# EAGLE design datalogger-v12 (EAGLE 7.7.0)
DATABASE: /Users/kina/Documents/eagle/PARTSDB.txt

## Sheet 1 of 2
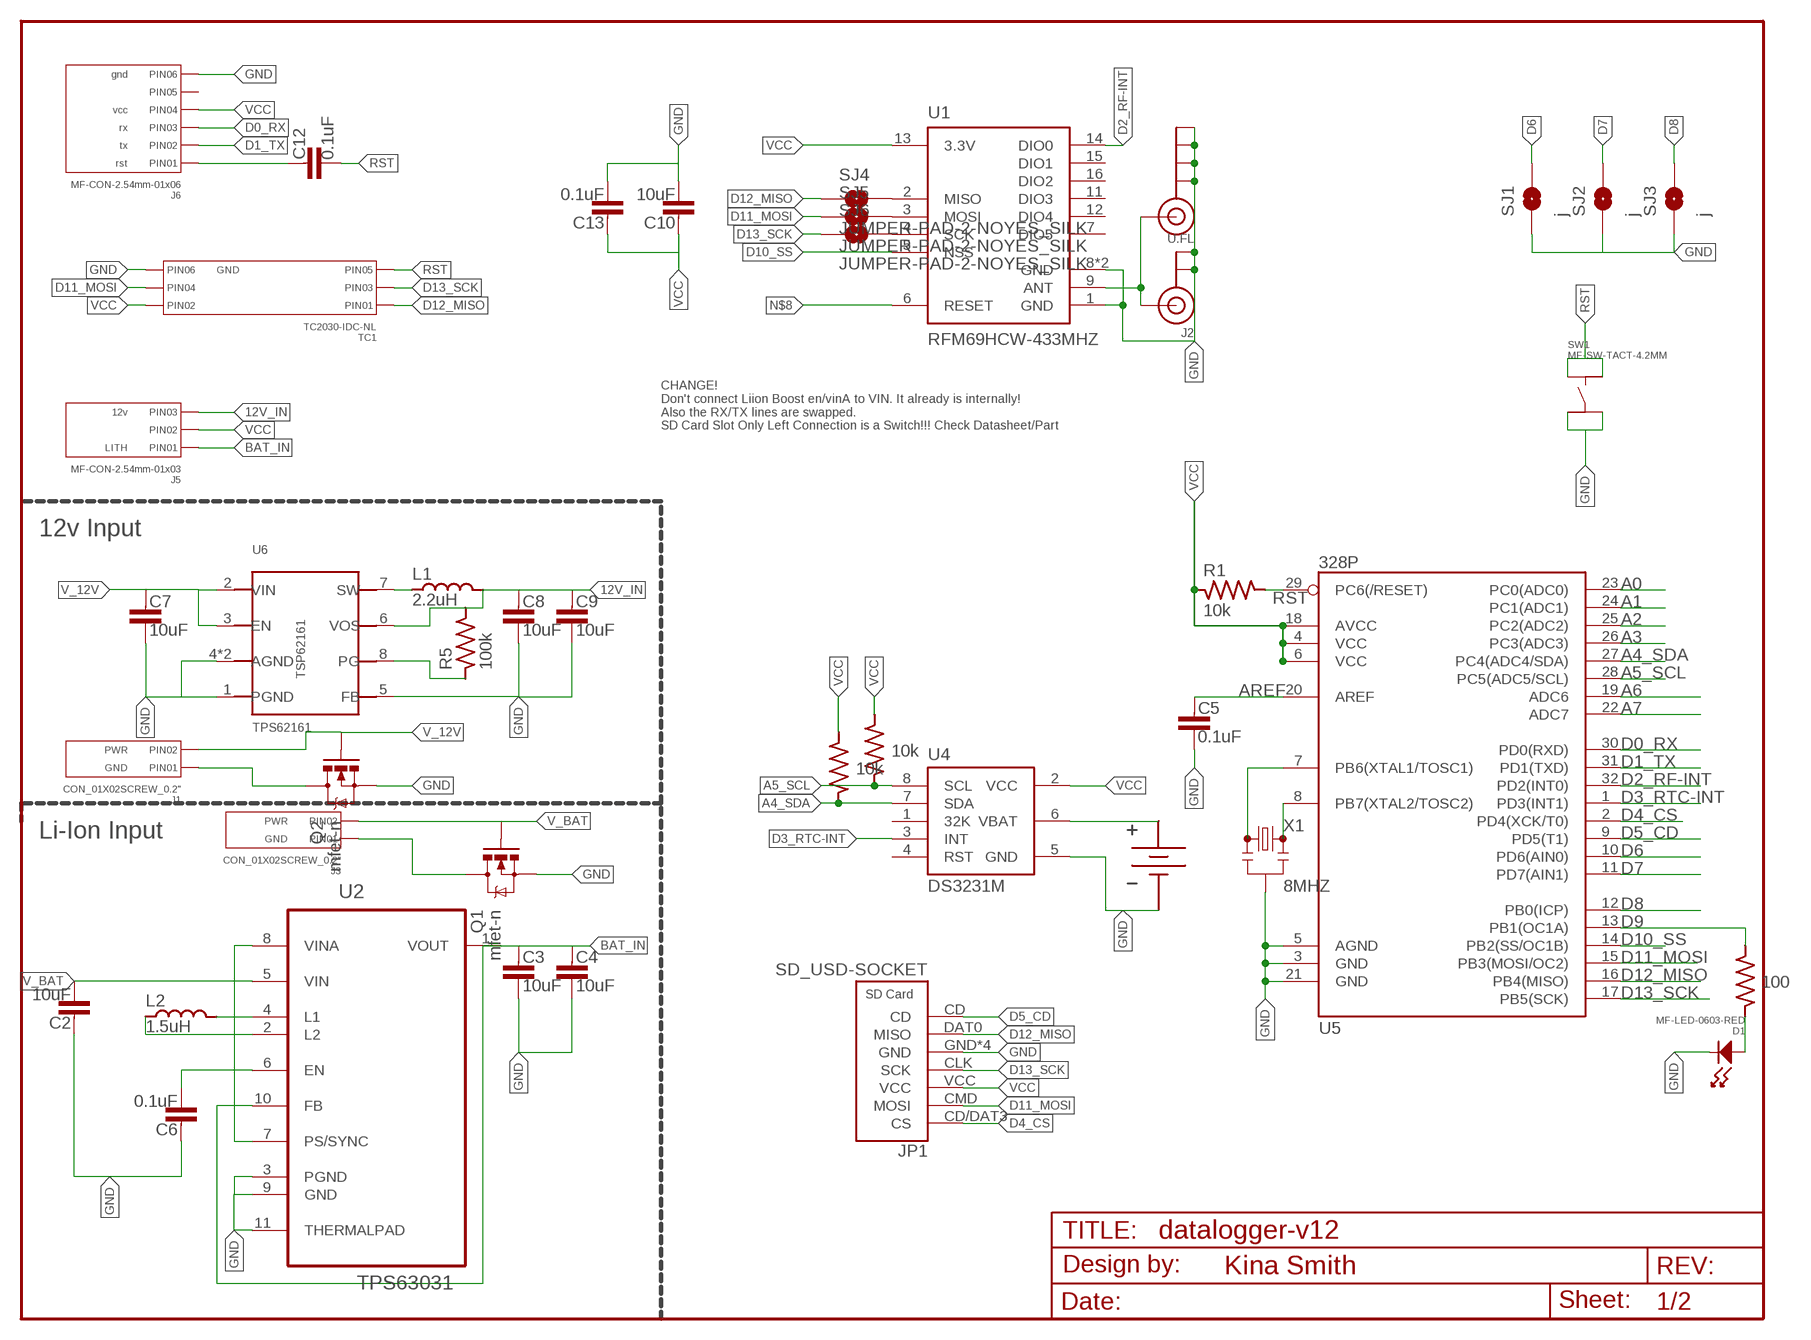
[diagram p0: schematic, sheet 1]

### Parts
BAT1  BATTERY_HOLDER12MM  [BAT_12MM]
C2  10uF  CAPACITOR_NP0805-N  [C0805-N]
C3  10uF  CAPACITOR_NP0805-N  [C0805-N]
C4  10uF  CAPACITOR_NP0805-N  [C0805-N]
C5  0.1uF  CAPACITOR_NP0603-N  [C0603-N]
C6  0.1uF  CAPACITOR_NP0603-N  [C0603-N]
C7  10uF  CAPACITOR_NP0805-N  [C0805-N]
C8  10uF  CAPACITOR_NP0805-N  [C0805-N]
C9  10uF  CAPACITOR_NP0805-N  [C0805-N]
C10  10uF  CAPACITOR_NP0805-N  [C0805-N]
C12  0.1uF  CAPACITOR_NP0603-N  [C0603-N]
C13  0.1uF  CAPACITOR_NP0603-N  [C0603-N]
D1  MF-LED-0603-RED  LED_SINGLE-0603-RED  [LED0603]
FRAME1  FRAME-LETTERNO_PACKAGE  [DUMMY]
J1  CON_01X02SCREW_0.2"  [SCREW_TERM_2POS]
J2  U.FL  ANTENNA_U.FL  [ADAFRUIT_U.FL]
J3  CON_01X02SCREW_0.2"  [SCREW_TERM_2POS]
J4  ANTENNA_SMA_EDGE  [SMA-EDGE]
J5  MF-CON-2.54mm-01x03  CON_01X03_PTH_2.54MM  [PTH_2.54MM_01X03]
J6  MF-CON-2.54mm-01x06  CON_01X06_PTH_2.54MM  [PTH_2.54MM_01X06]
JP1  SD_USD-SOCKET  [MICRO-SD-SOCKET-SDIO]
L1  2.2uH  INDUCTOR2520  [L2520]
L2  1.5uH  INDUCTOR3030  [L3030]
Q1  mfet-n  MOSFET-NCHANNELSOT23-3  [SOT23-3]
Q2  mfet-n  MOSFET-NCHANNELSOT23-3  [SOT23-3]
R1  10k  RESISTOR0603-N  [R0603-N]
R2  100  RESISTOR0603-N  [R0603-N]
R3  10k  RESISTOR0603-N  [R0603-N]
R4  10k  RESISTOR0603-N  [R0603-N]
R5  100k  RESISTOR0603-N  [R0603-N]
SJ1  j  JUMPER-PAD-2-NOYES_SILK  [PAD-JUMPER-2-NO_YES_SILK]
SJ2  j  JUMPER-PAD-2-NOYES_SILK  [PAD-JUMPER-2-NO_YES_SILK]
SJ3  j  JUMPER-PAD-2-NOYES_SILK  [PAD-JUMPER-2-NO_YES_SILK]
SJ4  JUMPER-PAD-2-NOYES_SILK  [PAD-JUMPER-2-NO_YES_SILK]
SJ5  JUMPER-PAD-2-NOYES_SILK  [PAD-JUMPER-2-NO_YES_SILK]
SJ6  JUMPER-PAD-2-NOYES_SILK  [PAD-JUMPER-2-NO_YES_SILK]
SW1  MF-SW-TACT-4.2MM  TACT_4.2MM  [TACT4.2MM]
TC1  TC2030-IDC-NL  CON_02X03_AVRISP_TC2030-IDC-NL  [TC2030-IDC-NL]
U1  RFM69HCW-433MHZ  [RFM69HCW-XXXS2]
U2  TPS63031  [SON50P260X260X80-11N]
U4  DS3231M  [SO08]
U5  328P  ATMEGA328P-AU  [TQFP32-08]
U6  TPS62161  [WSON-8]
X1  8MHZ  RESONATOR8MHZ  [RESONATOR-SMD]

### Nets
3V3L1: L2.P$2 U2.4(L1)
3V3L2: L2.P$1 U2.2(L2)
12V_IN: C8.1 C9.1 J5.P$3(PIN3) L1.P$2 R5.2 U6.6(VOS)
A0: U5.23(PC0(ADC0))
A1: U5.24(PC1(ADC1))
A2: U5.25(PC2(ADC2))
A3: U5.26(PC3(ADC3))
A4_SDA: R4.1 U4.7(SDA) U5.27(PC4(ADC4/SDA))
A5_SCL: R3.1 U4.8(SCL) U5.28(PC5(ADC5/SCL))
A6: U5.19(ADC6)
A7: U5.22(ADC7)
ANT: J2.3(SIGNAL) J4.SIG(SIGNAL) U1.9(ANT)
AREF: C5.1 U5.20(AREF)
BAT_IN: C3.1 C4.1 J5.P$1(PIN1) U2.1(VOUT) U2.10(FB)
D0_RX: J6.P$3(PIN3) U5.30(PD0(RXD))
D1_TX: J6.P$2(PIN2) U5.31(PD1(TXD))
D2_RF-INT: U1.14(DIO0) U5.32(PD2(INT0))
D3_RTC-INT: U4.3(INT) U5.1(PD3(INT1))
D4_CS: JP1.CD/DAT3(CS) U5.2(PD4(XCK/T0))
D5_CD: JP1.CD U5.9(PD5(T1))
D6: SJ1.2 U5.10(PD6(AIN0))
D7: SJ2.2 U5.11(PD7(AIN1))
D8: SJ3.2 U5.12(PB0(ICP))
D9: R2.2 U5.13(PB1(OC1A))
D10_SS: U1.5(NSS) U5.14(PB2(SS/OC1B))
D11_MOSI: JP1.CMD(MOSI) SJ5.1 TC1.P$4(PIN4) U5.15(PB3(MOSI/OC2))
D12_MISO: JP1.DAT0(MISO) SJ4.1 TC1.P$1(PIN1) U5.16(PB4(MISO))
D13_SCK: JP1.CLK(SCK) SJ6.1 TC1.P$3(PIN3) U5.17(PB5(SCK))
EN: C6.2 U2.6(EN) U2.7(PS/SYNC) U2.8(VINA)
GND [power]: BAT1.GND C2.1 C3.2 C4.2 C5.2 C6.1 C7.2 C8.2 C9.2 C10.2 C13.2 D1.CATHODE J2.1(GND) J2.2(GND) J4.GND@0(GND) J4.GND@1(GND) J4.GND@2(GND) J4.GND@3(GND) J6.P$6(PIN6) JP1.GND JP1.GND1(GND) JP1.GND2(GND) JP1.GND3(GND) Q1.2(S) Q2.2(S) SJ1.1 SJ2.1 SJ3.1 SW1.P$3 SW1.P$4 TC1.P$6(PIN6) U1.1(GND) U1.8(GND) U1.10(GND) U2.3(PGND) U2.9(GND) U2.11(THERMALPAD) U4.5(GND) U5.3(GND) U5.5(AGND) U5.21(GND) U6.1(PGND) U6.4(AGND) U6.5(FB) U6.P$9(AGND) X1.2
N$1: U5.7(PB6(XTAL1/TOSC1)) X1.1
N$2: D1.ANODE R2.1
N$4: C12.1 J6.P$1(PIN1)
N$5: J3.GND(PIN1) Q1.3(D)
N$7: SJ4.2 U1.2(MISO)
N$8: U1.6(RESET)
N$9: SJ5.2 U1.3(MOSI)
N$10: BAT1.PWR@1(VBAT) BAT1.PWR@2(VBAT) U4.6(VBAT)
N$11: J1.GND(PIN1) Q2.3(D)
N$15: SJ6.2 U1.4(SCK)
N$18: R5.1 U6.8(PG)
N$21: U5.8(PB7(XTAL2/TOSC2)) X1.3
RST: C12.2 R1.2 SW1.P$1 SW1.P$2 TC1.P$5(PIN5) U5.29(PC6(/RESET))
SW: L1.P$1 U6.7(SW)
V_12V: C7.1 J1.PWR(PIN2) Q2.1(G) U6.2(VIN) U6.3(EN)
V_BAT: C2.2 J3.PWR(PIN2) Q1.1(G) U2.5(VIN)
VCC: C10.1 C13.1 J5.P$2(PIN2) J6.P$4(PIN4) JP1.VCC R1.1 R3.2 R4.2 TC1.P$2(PIN2) U1.13(3.3V) U4.2(VCC) U5.4(VCC) U5.6(VCC) U5.18(AVCC)
Unconnected: J6.P$5(PIN5) U1.7(DIO5) U1.11(DIO3) U1.12(DIO4) U1.15(DIO1) U1.16(DIO2) U4.1(32K) U4.4(RST)

### Notes on the sheet
- CHANGE!
  Don't connect Liion Boost en/vinA to VIN. It already is internally!
  Also the RX/TX lines are swapped. 
  SD Card Slot Only Left Connection is a Switch!!! Check Datasheet/Part
- 12v Input
- Li-Ion Input

## Sheet 2 of 2
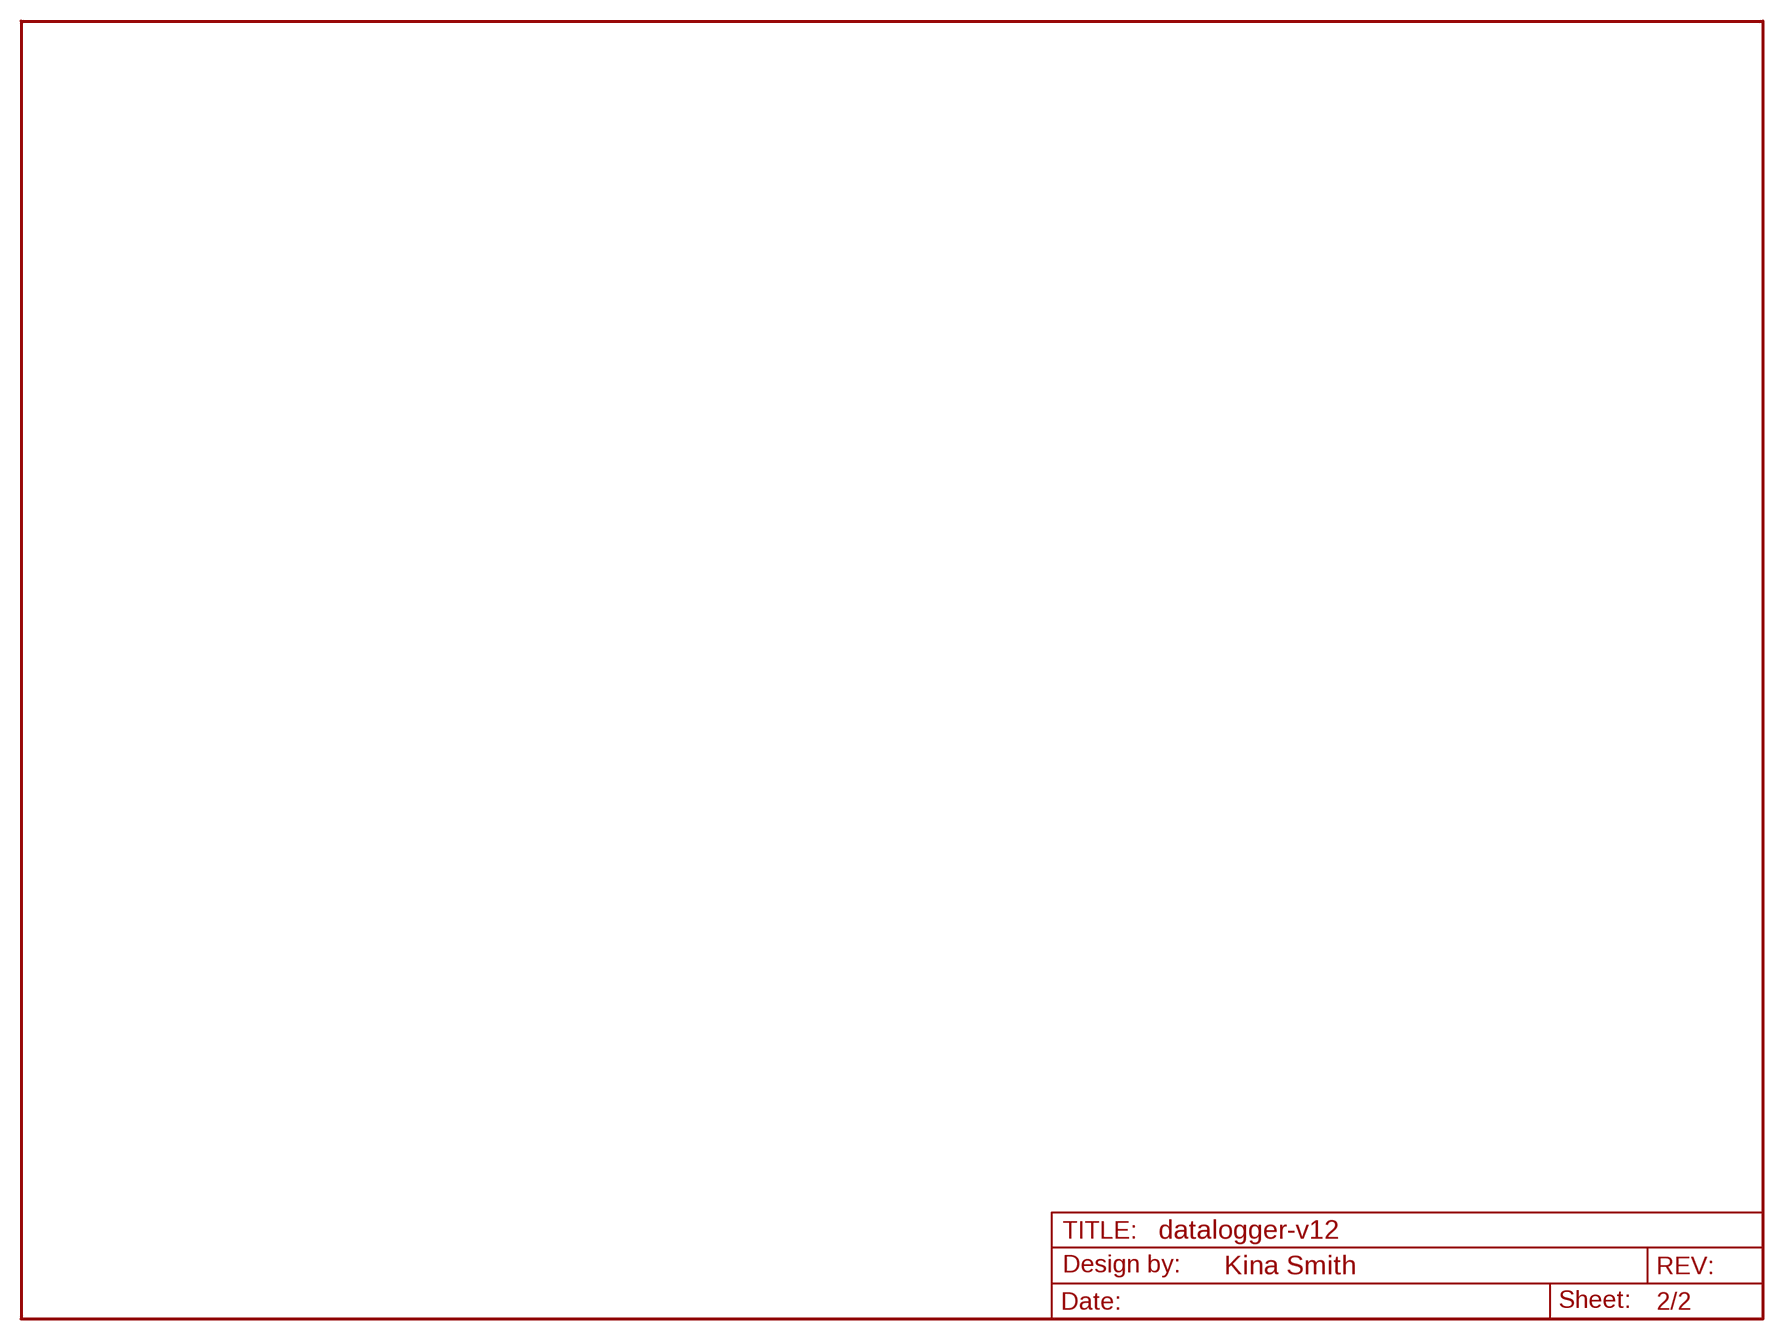
[diagram p1: schematic, sheet 2]

### Parts
FRAME3  FRAME-LETTERNO_PACKAGE  [DUMMY]

## Library data of the parts
BAT1 = My_Connectors:BATTERY_HOLDER; PARTNO: BK-885-TR
C2-C4 C7-C10 = My_Passives:CAPACITOR_NP; PARTNO: GRM21BR61C106KE15L
C5 C6 C12 C13 = My_Passives:CAPACITOR_NP; PARTNO: CC0603KRX7R7BB104
D1 = My_LEDs:LED_SINGLE: Library: MF_LEDs Description: Device for Single LED Packages. Manufacture part number (MFG#) can be added via Attributes.; HOUSEPART: YES; MPN: MF-LED-0603-RED; PARTNO: LTST-C191KRKT; POPULATE: 1; URL: https://factory.macrofab.com/part/MF-LED-0603-RED
FRAME1 FRAME3 = _my-parts:FRAME-LETTER: Schematic Frame Standard 8.5x11 US Letter frame; DESIGNER: Nobody; VERSION: v01
J1 J3 = My_Connectors:CON_01X02: Library: MF_Connectors Description: Header Connector with 02 Positions and 01 Rows. Use the LABEL Attribute to label the pin on the schematic and PCB. You can remove the attributes on the PCB by using the SMASH function on the part and then deleting the text.; LABEL01: GND; LABEL02: PWR; PARTNO: 1729128
J2 = My_Connectors:ANTENNA_U.FL: U.FL Antenna Connector; PARTNO: U.FL-R-SMT-1(10)
J4 = My_Connectors:ANTENNA_SMA_EDGE: SMA Antenna Connector End launch SMA connector. The paste layer has been removed so that the connector can be hand soldered onto the board after reflow.; PARTNO: EMPCB.SMAFSTJ.B.HT
J5 = My_Connectors:CON_01X03: Library: MF_Connectors Description: Header Connector with 03 Positions and 01 Rows. Use the LABEL Attribute to label the pin on the schematic and PCB. You can remove the attributes on the PCB by using the SMASH function on the part and then deleting the text.; HOUSEPART: YES; LABEL01: LITH; LABEL03: 12v; MPN: MF-CON-2.54mm-01x03; PARTNO: NA; POPULATE: 1; URL: https://factory.macrofab.com/part/MF-CON-2.54mm-01x03
J6 = My_Connectors:CON_01X06: Library: MF_Connectors Description: Header Connector with 6 Positions and 01 Rows. Use the LABEL Attribute to label the pin on the schematic and PCB. You can remove the attributes on the PCB by using the SMASH function on the part and then deleting the text.; HOUSEPART: YES; LABEL01: rst; LABEL02: tx; LABEL03: rx; LABEL04: vcc; LABEL06: gnd; MPN: MF-CON-2.54mm-01x06; PARTNO: NA; POPULATE: 1; URL: https://factory.macrofab.com/part/MF-CON-2.54mm-01x06
JP1 = My_Connectors:SD_USD-SOCKET: microSD Socket Push-push type uSD socket with full SDIO signal mapping. Spark Fun Electronics SKU : PRT-00127. tDoc lines correctly indicate media card edge positions when inserting (unlocked, locked, depressed). NOTE: CD1 and CD2 are connected internally, and short to ground when card is removed.; PARTNO: 101-00660-68-6; PROD_ID: CONN-07820
L1 = My_Passives:INDUCTOR; PARTNO: VLS252012T-2R2M1R3
L2 = My_Passives:INDUCTOR; PARTNO: NR3015T1R5N
Q1 Q2 = My_Descrete_Semiconductors:MOSFET-NCHANNEL: Common NMOSFET Parts MFG P/N Store ID Prod ID FDD8780 TRANS-09984 SI7820DN TRANS-11055 FDS6630A IC-08089 2N7002PW TRANS-11151 FQP30N06L COM-10213 TRANS-10060 BSS123LT1G TRANS-08345 BSS138 TRANS-00830 BS170 2N7000; PARTNO: SI2312BDS-T1-GE3
R1 R3 R4 = My_Passives:RESISTOR; PARTNO: RC0603FR-0710KL
R2 = My_Passives:RESISTOR; PARTNO: RC0603FR-07100RL
R5 = My_Passives:RESISTOR; PARTNO: RC0603FR-07100KL
SJ1-SJ6 = My_Passives:JUMPER-PAD-2-NO; PARTNO: NA
SW1 = My_ElectroMechanical:TACT: Library: MF_Switches Description: Device for Tact Switches. Manufacture part number (MFG#) can be added via Attributes.; HOUSEPART: YES; MPN: MF-SW-TACT-4.2MM; PARTNO: PTS810 SJM 250 SMTR LFS; POPULATE: 1; URL: https://factory.macrofab.com/part/MF-SW-TACT-4.2MM
TC1 = My_Connectors:CON_02X03: Library: MF_Connectors Description: Header Connector with 6 Positions and 02 Rows. Use the LABEL Attribute to label the pin on the schematic and PCB. You can remove the attributes on the PCB by using the SMASH function on the part and then deleting the text.; HOUSEPART: NO; LABEL06: GND; MPN: TC2030-IDC-NL; PARTNO: NA; POPULATE: 0; URL: http://www.tag-connect.com/AVRISP
U1 = My_RF:RFM69H; PARTNO: COM-13910; PROD_ID: IC-11997, IC-12053
U2 = My_IC_Power:TPS63031: HIGH EFFICIENCY SINGLE INDUCTOR BUCK-BOOST CONVERTER WITH 1-A SWITCHES; MPN: TPS63031DSK; OC_FARNELL: 1686303; OC_NEWARK: 19P7478; PACKAGE: SON-10; PARTNO: TPS63031DSKR; SUPPLIER: Texas Instruments
U4 = My_IC_Digital:DS3231M: The DS3231M is a low-cost extremely accurate I2C realtime clock (RTC). Datasheet <https://datasheets.maximintegrated.com/en/ds/DS3231M.pdf>; PARTNO: DS3231MZ/V+
U5 = My_IC_Digital:ATMEGA328P: Atmel 32-pin 8-bit micro 16k flash.; PARTNO: ATMEGA328P-AU
U6 = My_IC_Power:TPS62161; PARTNO: TPS62161DSGR
X1 = My_xTal:RESONATOR: Resonator Small SMD resonator. Used, eg, on the Arduino Pro/ Pro Mini boards. 8MHz- XTAL-08895 16MHz- XTAL-08900; PARTNO: CSTCE8M00G55-R0; PROD_ID: XTAL-08895

## Net classes
1 power: width 0.381 mm, clearance 0.254 mm

## Board
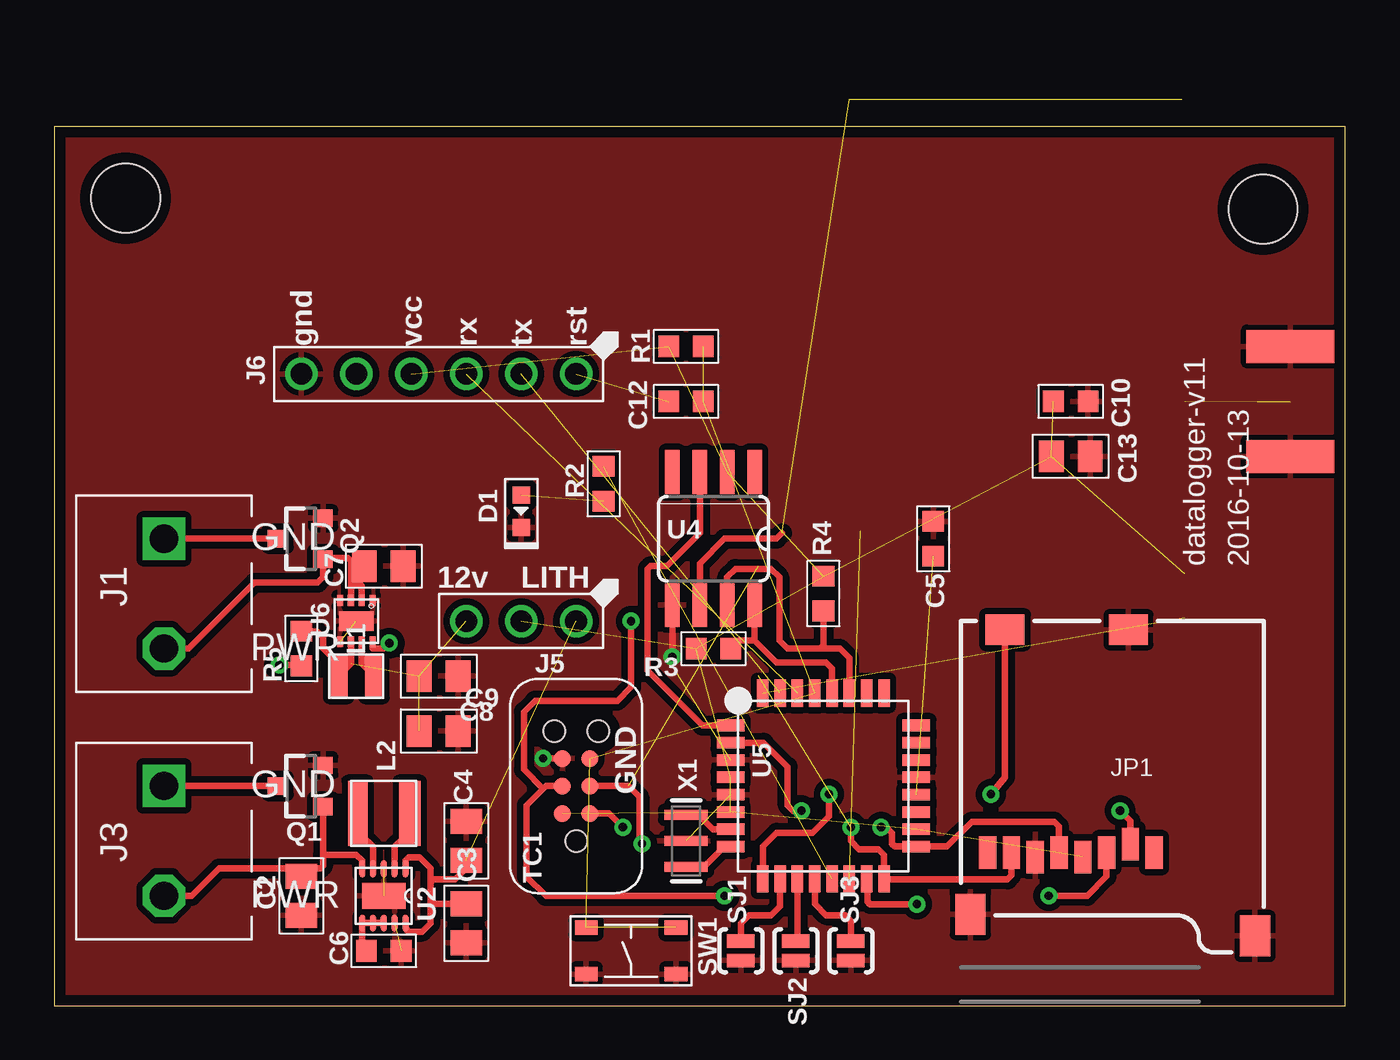
[diagram p2: board, top side]
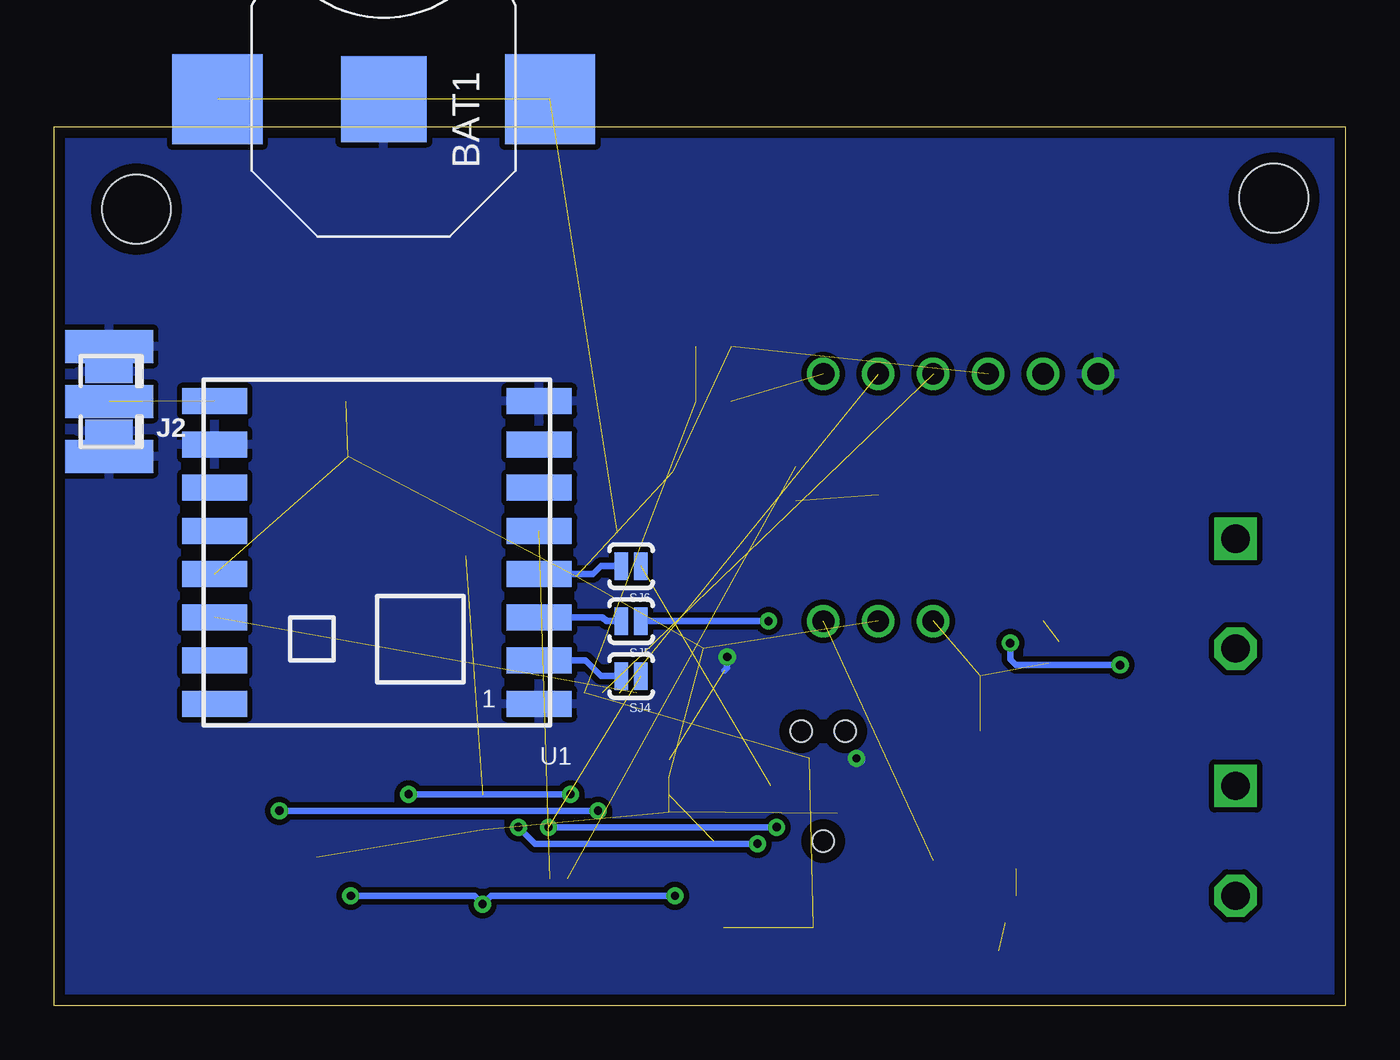
[diagram p3: board, bottom side, seen from below]

Size 59.69 x 40.64 mm. Coordinates in mm from the lower left corner, seen from the top.
Outline: 0,0 59.69,0 59.69,40.64 0,40.64 0,0
Copper layers (1*16): Top 0.0178mm / dielectric 59mil / Bottom 0.0178mm
Design rules "SSC-EAGLE-2Lyr_v1.0.0.3": minimum track width 6mil, minimum drill 14mil, track to track 6mil, track to pad 6mil, pad to pad 6mil, via to via 6mil, smd to smd 6mil, copper to edge 20mil, drill to drill 16mil, minimum pad ring 8mil, minimum via ring 8mil, stop-mask expansion 3mil, vias tented up to drill 0mil, thermal gap 10mil
Holes 3.17 mm at 3.3,37.34 55.88,36.83

### Footprints (pad centres in the part's own frame; a part is rotated, then mirrored left to right if it is on the bottom)
BAT_12MM = smd 3.962 x 3.962: GND 0,0 | smd 4.17 x 4.17: PWR@1 -7.685,0; PWR@2 7.685,0
C0805-N = smd 1.15 x 1.45: 1 -0.9,0; 2 0.9,0
C0603-N = smd 0.95 x 1: 1 -0.8,0; 2 0.8,0
LED0603 = smd 0.8 x 0.8: ANODE 0.75,0; CATHODE -0.75,0
SCREW_TERM_2POS = drill 1.3 square: GND -2.54,0 | drill 1.3 octagon: PWR 2.54,0
ADAFRUIT_U.FL = smd 2.2 x 1.05: 1 0,1.375; 2 0,-1.375 | smd 0.8 x 1: 3 1.525,0
SMA-EDGE = smd 1.524 x 4.064: GND@0 0,0; GND@1 5.08,0; SIG 2.54,0 | smd 1.524 x 4.064 bottom: GND@2 0,0; GND@3 5.08,0
PTH_2.54MM_01X03 = drill 1: P$1 -2.54,0; P$2 0,0; P$3 2.54,0
PTH_2.54MM_01X06 = drill 1: P$1 -6.35,0; P$2 -3.81,0; P$3 -1.27,0; P$4 1.27,0; P$5 3.81,0; P$6 6.35,0
MICRO-SD-SOCKET-SDIO = smd 1.8 x 1.4: CD 11.92,0.4; GND2 6.22,0.4 | smd 0.8 x 1.5: CD/DAT3 6.13,10.3; CLK 9.43,10.7; CMD 7.23,10.7; DAT0 11.63,10.7; DAT1 12.73,10.7; DAT2 5.03,10.7; GND 10.53,10.9; VCC 8.33,10.9 | smd 1.4 x 1.9: GND1 0.37,14.55; GND3 13.52,13.55
L2520 = smd 0.85 x 2: P$1 -0.825,0; P$2 0.825,0
L3030 = smd 1 x 3: P$1 -1.2,0 | smd 0.9 x 3: P$2 1.2,0
SOT23-3 = smd 0.8 x 0.9: 1 -0.95,-1; 2 0.95,-1; 3 0,1.1
R0603-N = smd 0.95 x 1: 1 -0.8,0; 2 0.8,0
PAD-JUMPER-2-NO_YES_SILK = smd 0.635 x 1.27: 1 -0.45,0; 2 0.45,0
TACT4.2MM = smd 1.05 x 0.65: P$1 -2.075,1.075; P$2 2.075,1.075; P$3 -2.075,-1.075; P$4 2.075,-1.075
TC2030-IDC-NL = smd 0.787 x 0.787: P$1 -1.27,-0.635; P$2 -1.27,0.635; P$3 0,-0.635; P$4 0,0.635; P$5 1.27,-0.635; P$6 1.27,0.635 | hole 0.991: 2.54,1.016; 2.54,-1.016; -2.54,0
RFM69HCW-XXXS2 = smd 3 x 1.2: 1 -7.5,7; 2 -7.5,5; 3 -7.5,3; 4 -7.5,1; 5 -7.5,-1; 6 -7.5,-3; 7 -7.5,-5; 8 -7.5,-7; 9 7.5,-7; 10 7.5,-5; 11 7.5,-3; 12 7.5,-1; 13 7.5,1; 14 7.5,3; 15 7.5,5; 16 7.5,7
SON50P260X260X80-11N = smd 0.8 x 0.289: 1 -1.25,1; 2 -1.25,0.5; 3 -1.25,0; 4 -1.25,-0.5; 5 -1.25,-1; 6 1.25,-1; 7 1.25,-0.5; 8 1.25,0; 9 1.25,0.5; 10 1.25,1 | smd 1.2 x 2: 11 0,0
SO08 = smd 0.66 x 2.032: 1 -1.905,-3.073; 2 -0.635,-3.073; 3 0.635,-3.073; 4 1.905,-3.073; 5 1.905,3.073; 6 0.635,3.073; 7 -0.635,3.073; 8 -1.905,3.073
TQFP32-08 = smd 1.27 x 0.533: 1 -4.293,2.8; 2 -4.293,2; 3 -4.293,1.2; 4 -4.293,0.4; 5 -4.293,-0.4; 6 -4.293,-1.2; 7 -4.293,-2; 8 -4.293,-2.8; 17 4.293,-2.8; 18 4.293,-2; 19 4.293,-1.2; 20 4.293,-0.4; 21 4.293,0.4; 22 4.293,1.2; 23 4.293,2; 24 4.293,2.8 | smd 0.533 x 1.27: 9 -2.8,-4.293; 10 -2,-4.293; 11 -1.2,-4.293; 12 -0.4,-4.293; 13 0.4,-4.293; 14 1.2,-4.293; 15 2,-4.293; 16 2.8,-4.293; 25 2.8,4.293; 26 2,4.293; 27 1.2,4.293; 28 0.4,4.293; 29 -0.4,4.293; 30 -1.2,4.293; 31 -2,4.293; 32 -2.8,4.293
WSON-8 = smd 0.28 x 0.5: 1 -0.75,-0.95; 2 -0.25,-0.95; 3 0.25,-0.95; 4 0.75,-0.95; 5 0.75,0.95; 6 0.25,0.95; 7 -0.25,0.95; 8 -0.75,0.95 | smd 1.6 x 0.9: P$9 0,0
RESONATOR-SMD = smd 0.45 x 2: 1 -1.2,0; 2 0,0; 3 1.2,0

### Placement (x,y rotation side)
BAT1  44.45,41.91 0 bottom
C2  11.43,5.08 90 top
C3  19.05,3.81 270 top
C4  19.05,7.62 90 top
C5  40.64,21.59 90 top
C6  15.24,2.54 180 top
C7  15.24,20.32 0 top
C8  17.78,15.24 0 top
C9  17.78,12.7 0 top
C10  46.99,25.4 0 top
C12  29.21,27.94 0 top
C13  46.99,27.94 0 top
D1  21.59,22.86 90 top
FRAME1  0,-1.27 0 top
FRAME3  1.27,-1.27 0 top
J1  5.08,19.05 270 top
J2  57.15,27.94 0 bottom
J3  5.08,7.62 270 top
J4  57.15,30.48 270 bottom
J5  21.59,17.78 180 top
J6  17.78,29.21 180 top
JP1  55.88,17.78 180 top
L1  13.97,15.24 180 top
L2  15.24,8.89 180 top
Q1  11.43,10.16 90 top
Q2  11.43,21.59 90 top
R1  29.21,30.48 0 top
R2  25.4,24.13 90 top
R3  30.48,16.51 180 top
R4  35.56,19.05 90 top
R5  11.43,16.51 90 top
SJ1  31.75,2.54 90 top
SJ2  34.29,2.54 90 top
SJ3  36.83,2.54 90 top
SJ4  33.02,15.24 180 bottom
SJ5  33.02,17.78 180 bottom
SJ6  33.02,20.32 180 bottom
SW1  26.67,2.54 0 top
TC1  24.13,10.16 90 top
U1  44.77,20.95 180 bottom
U2  15.24,5.08 270 top
U4  30.48,21.59 180 top
U5  35.56,10.16 0 top
U6  13.97,17.78 180 top
X1  29.21,7.62 270 top

### Tracks (layer width: path | path; a pad name or v marks a point on that pad's centre or on a via)
3V3L1
  Top 0.305: U2.4 14.74,7.36 14.22,7.87 14.22,8.71 L2.P$2
3V3L2
  Top 0.305: U2.2 15.74,7.36 16.13,7.75 16.13,8.58 L2.P$1
12V_IN  (3 unrouted)
  Top 0.305: U6.6 13.72,15.81 L1.P$2 12.95,15.43 12.95,16 12.45,16.51 12.45,17.02 12.15,17.31 R5.2
A4_SDA
  Top 0.305: U4.7 31.11,19.81 31.5,20.19 33.15,20.19 33.53,19.81 33.53,16.89 33.91,16.51 35.43,16.51 | 35.43,16.51 36.32,16.51 36.76,16.07 U5.27 | R4.1 35.56,16.64 35.43,16.51
A5_SCL
  Top 0.305: U5.28 35.96,15.6 35.69,15.88 33.4,15.88 32.38,16.89 | U4.8 32.38,16.89 | 32.38,16.89 31.66,16.89 R3.1
ANT  (2 unrouted)
AREF  (1 unrouted)
BAT_IN  (1 unrouted)
  Top 0.305: U2.10 16.24,3.57 16.38,3.43 17.02,3.43 17.4,3.81 17.4,4.7 | 17.4,4.7 17.4,5.71 | 17.4,5.71 17.4,6.35 16.89,6.86 16.38,6.86 16.24,6.71 U2.1 | C3.1 17.41,4.71 17.4,4.7 | C4.1 19.05,6.35 18.54,5.84 17.53,5.84 17.4,5.71
D0_RX  (1 unrouted)
D1_TX  (1 unrouted)
D2_RF-INT  (1 unrouted)
D3_RTC-INT
  Top 0.305: U4.3 29.84,21.84 28.32,20.32 27.56,20.32 27.43,20.19 27.43,15.49 29.97,12.95 U5.1
D4_CS  (via drill 0.38)
  Top 0.305: JP1.CD/DAT3 49.75,8.54 v49.28,9.02 | v34.54,9.02 34.16,9.02 33.91,9.27 33.91,11.05 32.8,12.16 U5.2
  Bottom 0.305: v49.28,9.02 v34.54,9.02
D5_CD  (via drill 0.38)
  Top 0.305: JP1.CD 43.96,10.56 v43.31,9.78 | v35.81,9.78 35.81,8.76 35.05,8 33.4,8 32.76,7.36 U5.9
  Bottom 0.305: v43.31,9.78 v35.81,9.78
D6
  Top 0.305: U5.10 33.56,4.6 33.15,4.19 32.13,4.19 31.75,3.81 SJ1.2
D7
  Top 0.305: U5.11 34.36,3.06 SJ2.2
D8
  Top 0.305: U5.12 35.16,4.72 35.69,4.19 36.58,4.19 36.83,3.94 SJ3.2
D9  (1 unrouted)
D10_SS  (1 unrouted)
D11_MOSI  (via drill 0.38)
  Top 0.305: JP1.CMD 48.65,5.98 47.75,5.08 v45.97,5.08 | v39.88,4.7 37.72,4.7 37.59,4.83 37.59,5.83 U5.15 | TC1.P$4 22.73,10.16 22.61,10.03 | 22.61,10.03 21.84,9.27 21.84,5.97 22.73,5.08 v30.99,5.08 | v26.67,17.78 26.67,14.73 26.04,14.1 22.23,14.1 21.72,13.59 21.72,10.92 22.61,10.03
  Bottom 0.305: v45.97,5.08 40.26,5.08 v39.88,4.7 39.5,5.08 v30.99,5.08 | SJ5.1 v26.67,17.78
D12_MISO  (via drill 0.38)  (1 unrouted)
  Top 0.305: JP1.DAT0 44.25,6.02 44.07,5.84 38.38,5.84 U5.16 38.35,6.99 38.1,7.24 37.21,7.24 36.83,7.62 v36.83,8.26 | TC1.P$1 25.65,8.89 v26.29,8.26
  Bottom 0.305: v26.29,8.26 v36.83,8.26
D13_SCK  (via drill 0.38)  (1 unrouted)
  Top 0.305: JP1.CLK 46.45,8.29 46.23,8.51 42.42,8.51 41.27,7.37 U5.17 38.86,7.37 38.73,7.49 38.73,8 38.48,8.26 v38.23,8.26 | TC1.P$3 26.54,10.16 27.05,9.65 27.05,7.49 v27.18,7.49
  Bottom 0.305: v27.18,7.49 37.47,7.49 v38.23,8.26
EN
  Top 0.305: U2.8 U2.7 U2.6 14.24,2.74 C6.2
GND  (via drill 0.38)  (5 unrouted)
  Top 0.305: U4.5 v28.57,16.13 | TC1.P$6 v22.61,11.43
  Bottom 0.305: v28.57,16.13 28.57,15.62 28.7,15.49 | v22.61,11.43 22.48,11.43 22.35,11.3
  pour Bottom: 0,0 59.69,0 59.69,40.64 0,40.64
  pour Top (isolate 0.305, rank 6): 0,0 59.69,0 59.69,40.64 0,40.64
N$1
  Top 0.305: X1.1 29.27,8.76 29.84,8.76 30.45,8.16 U5.7
N$2  (1 unrouted)
N$4  (1 unrouted)
N$5
  Top 0.305: J3.GND Q1.3
N$7
  Bottom 0.305: U1.2 35.13,15.96 34.42,15.24 SJ4.2
N$9
  Bottom 0.305: U1.3 34.34,17.95 34.16,17.78 SJ5.2
N$10  (2 unrouted)
  Top 0.305: U4.6 29.84,20.45 30.99,21.59 33.4,21.59 33.66,21.84
N$11
  Top 0.305: J1.GND Q2.3
N$15
  Bottom 0.305: U1.4 34.78,19.95 34.42,20.32 SJ6.2
N$18  (via drill 0.38)
  Top 0.305: U6.8 14.72,16.52 14.73,16.51 15.24,16.51 v15.49,16.76 | v10.41,15.75 11.39,15.75 R5.1
  Bottom 0.305: v15.49,16.76 15.49,16 15.24,15.75 v10.41,15.75
N$21
  Top 0.305: U5.8 30.98,7.36 30.1,6.48 29.27,6.48 X1.3
RST  (5 unrouted)
SW
  Top 0.305: U6.7 14.22,15.81 L1.P$1
V_12V
  Top 0.305: J1.PWR 6.22,16.51 9.27,19.56 12.19,19.56 12.45,19.81 12.45,20.62 Q2.1 12.49,20.7 13.59,20.7 13.72,20.57 13.72,20.32 | U6.3 13.72,19.43 | 13.72,19.43 13.72,20.32 | U6.2 14.22,19.43 13.72,19.43 | C7.1 13.72,20.32
V_BAT
  Top 0.305: J3.PWR 6.35,5.08 7.62,6.35 11.06,6.35 C2.2 11.8,6.35 12.32,6.35 12.43,6.46 12.43,6.99 | Q1.1 12.43,6.99 | U2.5 14.24,6.71 13.97,6.99 12.43,6.99
VCC  (13 unrouted)

### Text on the board
tNames: datalogger-v11 | 2016-10-13